# Altium project homecomputer-6502.PrjPcb
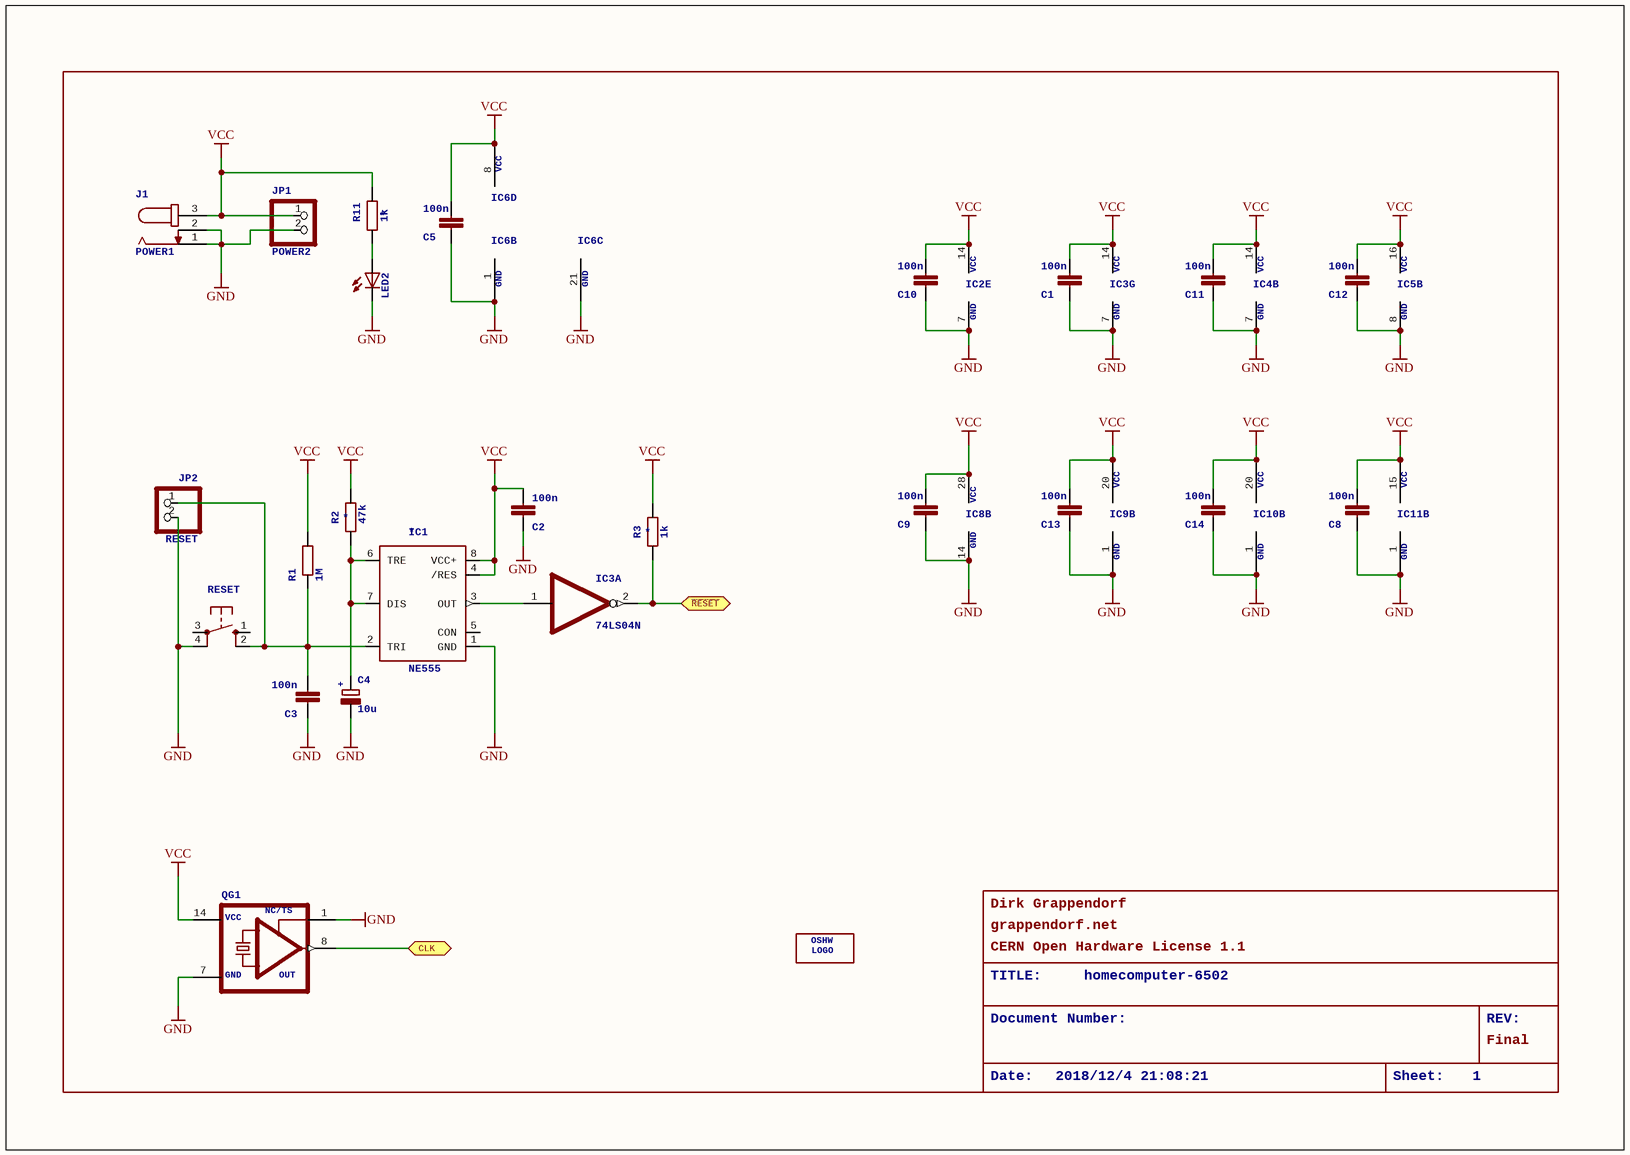
[diagram p0: homecomputer-6502_0.SchDoc]
6 sheets, 66 parts. Net scope: flat (ports and power ports of the same name join across sheets).
Board file: homecomputer-6502.PcbDoc
Sheets:
  homecomputer-6502_0.SchDoc
  homecomputer-6502_1.SchDoc
  homecomputer-6502_2.SchDoc
  homecomputer-6502_3.SchDoc
  homecomputer-6502_4.SchDoc
  homecomputer-6502_5.SchDoc

## Sheet homecomputer-6502_0.SchDoc: homecomputer-6502
size 286 x 202 mm; Date: 2018/12/4 21:08:21; SheetNumber: 1

### Parts
(Parts that share a designator on the sheet are numbered #1, #2 ... from top to bottom, then left to right.)
C1  100n  [C025-024X044]
C2  100n  [C025-024X044]
C3  100n  [C025-024X044]
C4  10u  [E2,5-6E]
C5  100n  [C025-024X044]
C8  100n  [C025-024X044]
C9  100n  [C025-024X044]
C10  100n  [C025-024X044]
C11  100n  [C025-024X044]
C12  100n  [C025-024X044]
C13  100n  [C025-024X044]
C14  100n  [C025-024X044]
IC1  NE555  [DIL-08]
IC2  74LS00N  [DIL14]  (value not drawn)  (part E of 5)
IC3  74LS04N  [DIL14]  (parts A,G of 7)
IC4  74*30N  [DIL14]  (value not drawn)  (part B of 2)
IC5  74*137N  [DIL16]  (value not drawn)  (part B of 2)
IC6  6502  [DIP40]  (value not drawn)  (parts B,C,D of 4)
IC8  61256  [DIL28-3]  (value not drawn)  (part B of 2)
IC9  6522  [DIP40]  (value not drawn)  (part B of 2)
IC10  6522  [DIP40]  (value not drawn)  (part B of 2)
IC11  6551  [DIP28]  (value not drawn)  (part B of 2)
J1  POWER1  [SPC4078]
JP1  POWER2  [1X02]
JP2  RESET  [1X02]
LED2  LED3MM  [LED3MM]  (value not drawn)
LOGO1  OSHW_LOGO_8MILX0350-NT  [OSHW_8X350_NOTEXT]  (value not drawn)
QG1  XO-14  [DIL14S]  (value not drawn)
R1  1M  [0204/7]
R2  47k  [0204/7]
R3  1k  [0204/7]
R11#1  1k  [0204/7]
RESET  10-XX  [B3F-10XX]  (value not drawn)

### Ports
CLK, ~{RESET}

### Nets
GND: C1.1 C2.1 C3.1 C4.- C5.1 C8.1 C9.1 C10.1 C11.1 C12.1 C13.1 C14.1 IC1.1(GND) IC2.7(GND) IC3.7(GND) IC4.7(GND) IC5.8(GND) IC6.1(GND) IC6.21(GND) IC8.14(GND) IC9.1(GND) IC10.1(GND) IC11.1(GND) J1.1 J1.2 JP1.2 JP2.2 LED2.K(C) QG1.1(TS) QG1.7(GND) RESET.4(P1)
VCC: C1.2 C2.2 C5.2 C8.2 C9.2 C10.2 C11.2 C12.2 C13.2 C14.2 IC1.4(/RES) IC1.8(VCC+) IC2.14(VCC) IC3.14(VCC) IC4.14(VCC) IC5.16(VCC) IC6.8(VCC) IC8.28(VCC) IC9.20(VCC) IC10.20(VCC) IC11.15(VCC) J1.3 JP1.1 QG1.14(VCC) R1.2 R2.2 R3.2 R11#1.2
NetC3_2: C3.2 IC1.2(TRI) JP2.1 R1.1 RESET.2(S1)
NetC4_+: C4.+ IC1.6(TRE) IC1.7(DIS) R2.1
NetIC1_3: IC1.3(OUT) IC3.1(I)
NetIC3_2: IC3.2(O) R3.1 ; port ~{RESET}
NetIC6_37: QG1.8(OUT) ; port CLK
NetLED2_A: LED2.A R11#1.1

Not connected (* = marked no-connect by the designer): IC1 5(CON); RESET 1(S) 3(P)

### Notes on the sheet
- Dirk Grappendorf
- grappendorf.net
- CERN Open Hardware License 1.1
- TITLE:
- Document Number:
- homecomputer-6502
- REV:
- Date:
- 2018/12/4 21:08:21
- Sheet:
- 1
- Final

### Library data of the parts
C1-C3 C5 C8-C14 = C-EU025-024X044: CAPACITOR, European symbol
C4 = CPOL-EUE2,5-6E: POLARIZED CAPACITOR, European symbol; +: +
IC1 = NE555: General purpose bipolar Timer; MPN: NE555N; MF: Arrow Electronics; NAME: *; OC_FARNELL: 1467742; OC_NEWARK: 89K1486
IC2 = 74*00N: Quad 2-input NAND gate; GND: GND; VCC: VCC
IC3 = 74*04N: Hex INVERTER
IC4 = 74*30N: 8-input NAND gate; GND: GND; VCC: VCC
IC5 = 74*137N: 3-line to 8-line DECODER/DEMULTIPLEXER, address LATCH; GND: GND; VCC: VCC
IC6 = 6502: 6502 processor; GND: GND
IC8 = 61256: MEMORY; GND: GND; VCC: VCC
IC9 IC10 = 6522: I/O device: two 8-bits ports, handshake lines, timers.; GND: GND; VCC: VCC
IC11 = 6551: ACIA. Capable of RS-232; GND: GND; VCC: VCC
J1 = JACK-PLUG1: DC POWER JACK Power Jack, DC, Right Angle, Through Hole, Rated 5A at 16VDC, PC Terminals   Distributor: Farnell (www.Farnell.de) Drawing: 84N1161.pdf / 84N1162.pdf Manufacturer: SPC Technology (www.spctechnology.com) Type: SPC4077 / SPC 4078; MF: *; MPN: *; OC_FARNELL: unknown; OC_NEWARK: unknown
JP1 JP2 = PINHD-1X2_2.54: PIN HEADER
LED2 = LED3MM: LED   OSRAM: - CHIPLED LG R971, LG N971, LY N971, LG Q971, LY Q971, LO R971, LY R971 LH N974, LH R974 LS Q976, LO Q976, LY Q976 LO Q996 - Hyper CHIPLED LW Q18S LB Q993, LB Q99A, LB R99A - SideLED LS A670, LO A670, LY A670, LG A670, LP A670 LB A673, LV A673, LT A673, LW A673 LH A674 LY A675 LS A676, LA A676, LO A676, LY A676, LW A676 LS A679, LY A679, LG A679 -  Hyper Micro SIDELED庐 LS Y876, LA Y876, LO Y876, LY Y876 LT Y87S - SmartLED LW L88C, LW L88S LB L89C, LB L89S, LG L890 LS L89K, LO L89K, LY L89K LS L896, LA L896, LO L896, LY L896 - TOPLED LS T670, LO T670, LY T670, LG T670, LP T670 LSG T670, LSP T670, LSY T670, LOP T670, LYG T670 LG T671, LOG T671, LSG T671 LB T673, LV T673, LT T673, LW T673 LH T674 LS T676, LA T676, LO T676, LY T676, LB T676, LH T676, LSB T676, LW T676 LB T67C, LV T67C, LT T67C, LS T67K, LO T67K, LY T67K, LW E67C LS E67B, LA E67B, LO E67B, LY E67B, LB E67C, LV E67C, LT E67C LW T67C LS T679, LY T679, LG T679 LS T770, LO T770, LY T770, LG T770, LP T770 LB T773, LV T773, LT T773, LW T773 LH T774 LS E675, LA E675, LY E675, LS T675 LS T776, LA T776, LO T776, LY T776, LB T776 LHGB T686 LT T68C, LB T68C - Hyper Mini TOPLED庐 LB M676 - Mini TOPLED Santana庐 LG M470 LS M47K, LO M47K, LY M47K    Source: http://www.osram.convergy.de   LUXEON: - LUMILED庐 LXK2-PW12-R00, LXK2-PW12-S00, LXK2-PW14-U00, LXK2-PW14-V00 LXK2-PM12-R00, LXK2-PM12-S00, LXK2-PM14-U00 LXK2-PE12-Q00, LXK2-PE12-R00, LXK2-PE12-S00, LXK2-PE14-T00, LXK2-PE14-U00 LXK2-PB12-K00, LXK2-PB12-L00, LXK2-PB12-M00, LXK2-PB14-N00, LXK2-PB14-P00, LXK2-PB14-Q00 LXK2-PR12-L00, LXK2-PR12-M00, LXK2-PR14-Q00, LXK2-PR14-R00 LXK2-PD12-Q00, LXK2-PD12-R00, LXK2-PD12-S00 LXK2-PH12-R00, LXK2-PH12-S00 LXK2-PL12-P00, LXK2-PL12-Q00, LXK2-PL12-R00    Source: www.luxeon.com   KINGBRIGHT:   KA-3528ASYC Source: www.kingbright.com
QG1 = XO-14: CRYSTAL; OUT: OUT; GND: GND; VCC: VCC; NC/TS: NC/TS
R1-R3 R11#1 = R-EU_0204/7: RESISTOR, European symbol
  R2 R3 R11#1: NAME: *
RESET = 10-XX: OMRON SWITCH; MPN: B3F-1000; MF: *; OC_FARNELL: 176432; OC_NEWARK: 36M3542
LOGO1 = OSHW_LOGO_8MILX0350-NT: OSHW: OSHW; LOGO: LOGO

## Sheet homecomputer-6502_1.SchDoc: homecomputer-6502
size 286 x 202 mm; Date: 2018/12/4 21:08:23; SheetNumber: 2
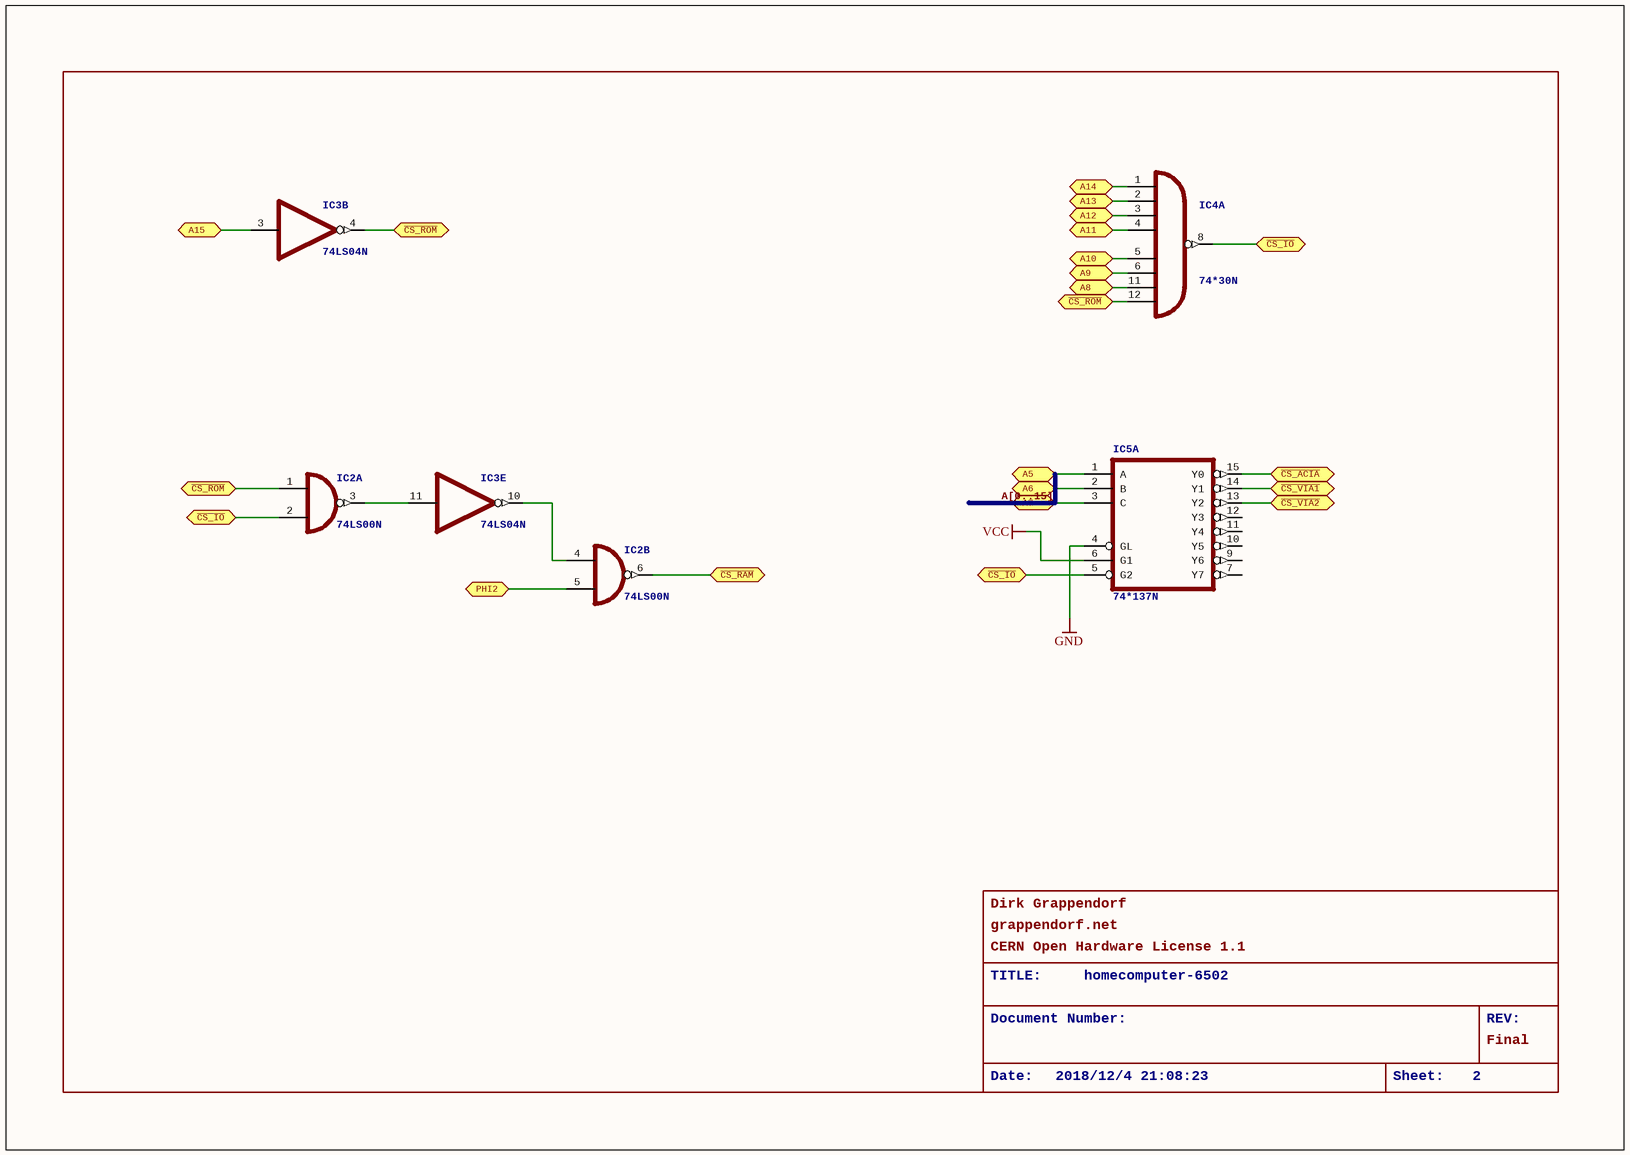
[diagram p1: homecomputer-6502_1.SchDoc]

### Parts
IC2  74LS00N  [DIL14]  (parts A,B of 5)
IC3  74LS04N  [DIL14]  (parts B,E of 7)
IC4  74*30N  [DIL14]  (part A of 2)
IC5  74*137N  [DIL16]  (part A of 2)

### Ports
A5, A6, A7, A8, A9, A10, A11, A12, A13, A14, A15, PHI2, ~{CS_ACIA}, ~{CS_IO}, ~{CS_RAM}, ~{CS_ROM}, ~{CS_VIA1}, ~{CS_VIA2}

### Nets
GND: IC5.4(GL)
VCC: IC5.6(G1)
A[0..15]: IC4.2(I1) ; port A13
A[0..15]: IC5.2(B) ; port A6  [a separate net that carries the same name]
NetIC2_1: IC2.1(I0) IC3.4(O) IC4.12(I7) ; port ~{CS_ROM}
NetIC2_2: IC2.2(I1) IC4.8(O) IC5.5(G2) ; port ~{CS_IO}
NetIC2_3: IC2.3(O) IC3.11(I)
NetIC2_4: IC2.4(I0) IC3.10(O)
NetIC2_5: IC2.5(I1) ; port PHI2
NetIC2_6: IC2.6(O) ; port ~{CS_RAM}
NetIC3_3: IC3.3(I) ; port A15
NetIC4_1: IC4.1(I0) ; port A14
NetIC4_3: IC4.3(I2) ; port A12
NetIC4_4: IC4.4(I3) ; port A11
NetIC4_5: IC4.5(I4) ; port A10
NetIC4_6: IC4.6(I5) ; port A9
NetIC4_11: IC4.11(I6) ; port A8
NetIC5_1: IC5.1(A) ; port A5
NetIC5_3: IC5.3(C) ; port A7
NetIC5_13: IC5.13(Y2) ; port ~{CS_VIA2}
NetIC5_14: IC5.14(Y1) ; port ~{CS_VIA1}
NetIC5_15: IC5.15(Y0) ; port ~{CS_ACIA}

Not connected (* = marked no-connect by the designer): IC5 7(Y7) 9(Y6) 10(Y5) 11(Y4) 12(Y3)

### Notes on the sheet
- Dirk Grappendorf
- grappendorf.net
- CERN Open Hardware License 1.1
- TITLE:
- Document Number:
- homecomputer-6502
- REV:
- Date:
- 2018/12/4 21:08:23
- Sheet:
- 2
- Final

### Library data of the parts
IC2 = 74*00N: Quad 2-input NAND gate
IC3 = 74*04N: Hex INVERTER
IC4 = 74*30N: 8-input NAND gate
IC5 = 74*137N: as IC5 on sheet homecomputer-6502_0

## Sheet homecomputer-6502_2.SchDoc: homecomputer-6502
size 286 x 202 mm; Date: 2018/12/4 21:08:25; SheetNumber: 3
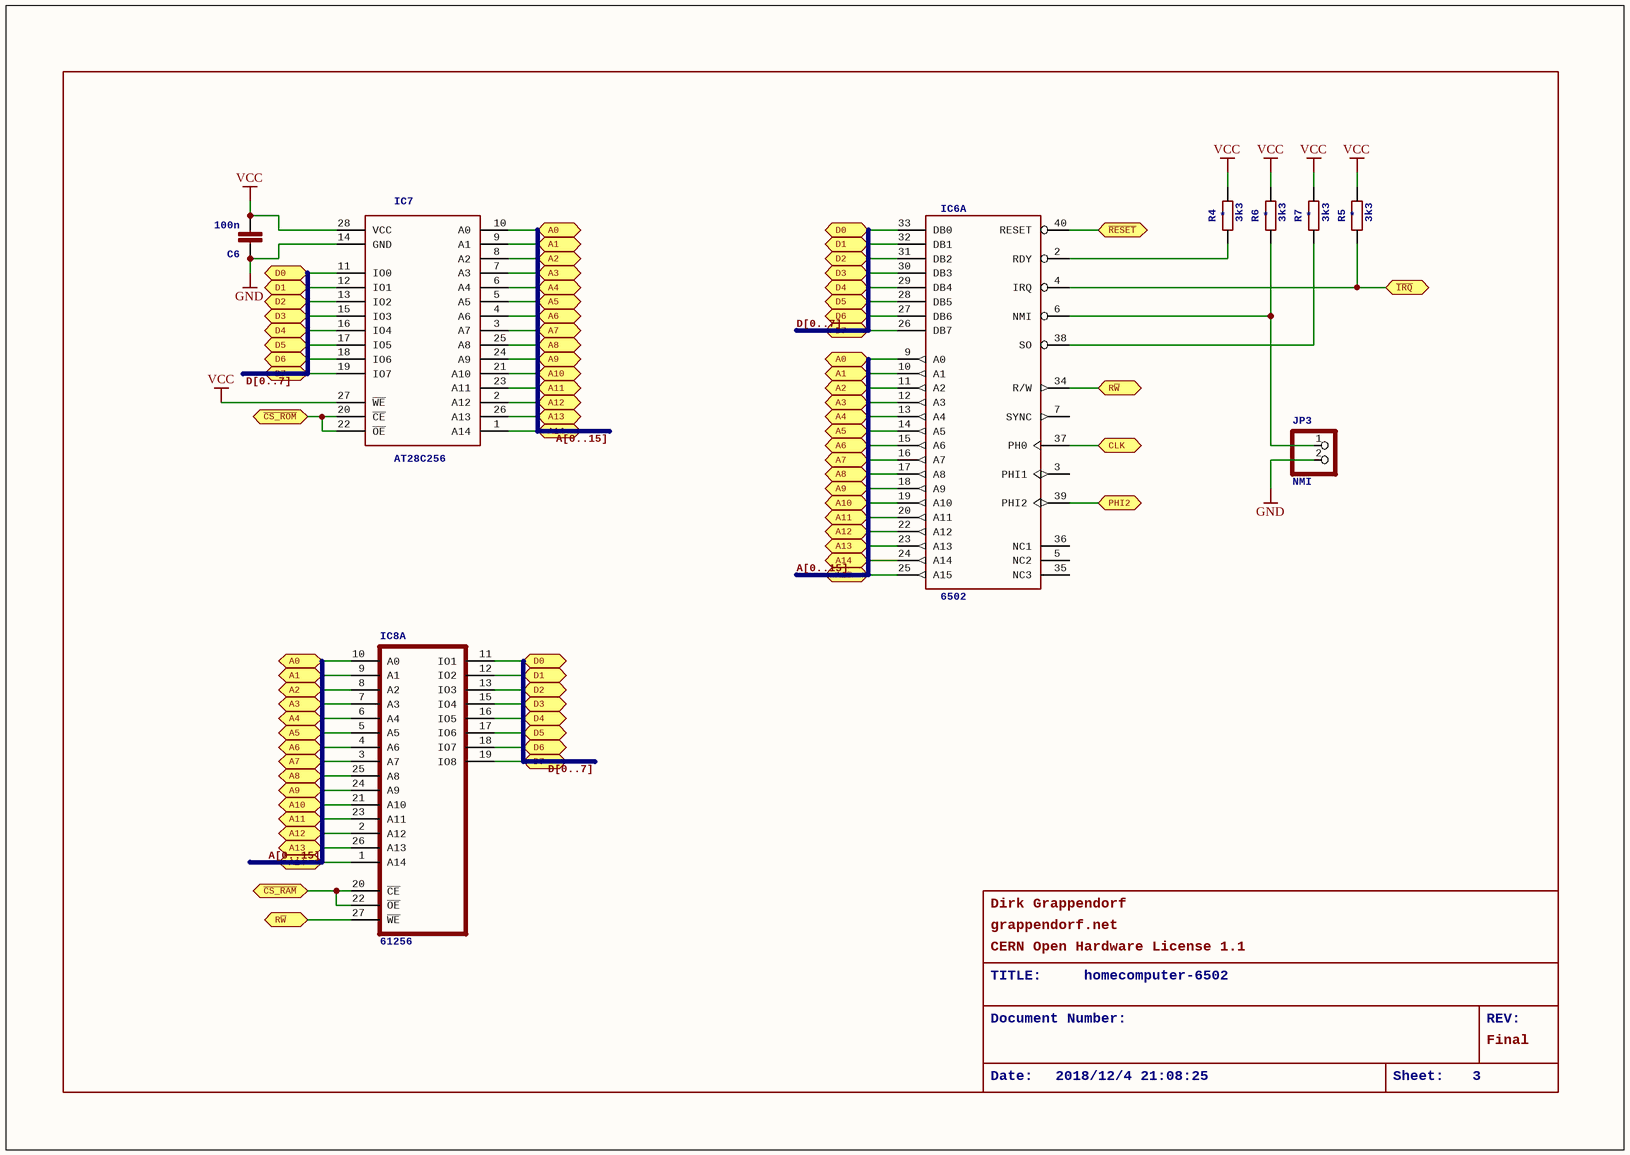
[diagram p2: homecomputer-6502_2.SchDoc]

### Parts
C6  100n  [C025-024X044]
IC6  6502  [DIP40]  (part A of 4)
IC7  AT28C256  [DIL28-6]
IC8  61256  [DIL28-3]  (part A of 2)
JP3  NMI  [1X02]
R4  3k3  [0204/7]
R5  3k3  [0204/7]
R6  3k3  [0204/7]
R7  3k3  [0204/7]

### Ports
A0, A1, A2, A3, A4, A5, A6, A7, A8, A9, A10, A11, A12, A13, A14, A15, CLK, D0, D1, D2, D3, D4, D5, D6, D7, PHI2, R~{W}, ~{CS_RAM}, ~{CS_ROM}, ~{IRQ}, ~{RESET}

### Nets
GND: C6.1 IC7.14(GND) JP3.2
VCC: C6.2 IC7.27(~{WE}) IC7.28(VCC) R4.2 R5.2 R6.2 R7.2
A[0..15]: IC6.23(A13) IC7.26(A13) IC8.26(A13) ; port A13
A[0..15]: IC6.15(A6) IC7.4(A6) IC8.4(A6) ; port A6  [a separate net that carries the same name]
A[0..15]: IC6.11(A2) IC7.8(A2) IC8.8(A2) ; port A2  [a separate net that carries the same name]
NetIC2_1: IC7.20(~{CE}) IC7.22(~{OE}) ; port ~{CS_ROM}
NetIC2_5: IC6.39(PHI2) ; port PHI2
NetIC2_6: IC8.20(~{CE}) IC8.22(~{OE}) ; port ~{CS_RAM}
NetIC3_2: IC6.40(RESET) ; port ~{RESET}
NetIC3_3: IC6.25(A15) ; port A15
NetIC4_1: IC6.24(A14) IC7.1(A14) IC8.1(A14) ; port A14
NetIC4_3: IC6.22(A12) IC7.2(A12) IC8.2(A12) ; port A12
NetIC4_4: IC6.20(A11) IC7.23(A11) IC8.23(A11) ; port A11
NetIC4_5: IC6.19(A10) IC7.21(A10) IC8.21(A10) ; port A10
NetIC4_6: IC6.18(A9) IC7.24(A9) IC8.24(A9) ; port A9
NetIC4_11: IC6.17(A8) IC7.25(A8) IC8.25(A8) ; port A8
NetIC5_1: IC6.14(A5) IC7.5(A5) IC8.5(A5) ; port A5
NetIC5_3: IC6.16(A7) IC7.3(A7) IC8.3(A7) ; port A7
NetIC6_2: IC6.2(RDY) R4.1
NetIC6_4: IC6.4(IRQ) R5.1 ; port ~{IRQ}
NetIC6_6: IC6.6(NMI) JP3.1 R6.1
NetIC6_9: IC6.9(A0) IC7.10(A0) IC8.10(A0) ; port A0
NetIC6_10: IC6.10(A1) IC7.9(A1) IC8.9(A1) ; port A1
NetIC6_12: IC6.12(A3) IC7.7(A3) IC8.7(A3) ; port A3
NetIC6_13: IC6.13(A4) IC7.6(A4) IC8.6(A4) ; port A4
NetIC6_26: IC6.26(DB7) IC7.19(IO7) IC8.19(IO8) ; port D7
NetIC6_27: IC6.27(DB6) IC7.18(IO6) IC8.18(IO7) ; port D6
NetIC6_28: IC6.28(DB5) IC7.17(IO5) IC8.17(IO6) ; port D5
NetIC6_29: IC6.29(DB4) IC7.16(IO4) IC8.16(IO5) ; port D4
NetIC6_30: IC6.30(DB3) IC7.15(IO3) IC8.15(IO4) ; port D3
NetIC6_31: IC6.31(DB2) IC7.13(IO2) IC8.13(IO3) ; port D2
NetIC6_32: IC6.32(DB1) IC7.12(IO1) IC8.12(IO2) ; port D1
NetIC6_33: IC6.33(DB0) IC7.11(IO0) IC8.11(IO1) ; port D0
NetIC6_34: IC6.34(R/W) IC8.27(~{WE}) ; port R~{W}
NetIC6_37: IC6.37(PH0) ; port CLK
NetIC6_38: IC6.38(SO) R7.1

Not connected (* = marked no-connect by the designer): IC6 3(PHI1) 5(NC2) 7(SYNC) 35(NC3) 36(NC1)

### Buses and harness runs
bus A[0..15]
bus D[0..7]

### Notes on the sheet
- Dirk Grappendorf
- grappendorf.net
- CERN Open Hardware License 1.1
- TITLE:
- Document Number:
- homecomputer-6502
- REV:
- Date:
- 2018/12/4 21:08:25
- Sheet:
- 3
- Final

### Library data of the parts
C6 = C-EU025-024X044: CAPACITOR, European symbol
IC6 = 6502: 6502 processor
IC7 = AT28C256: EEPROM 32Kx8 256k bit   The AT28C256 is a high-performance Electrically Erasable and Programmable Read Only Memory. Its 256K of memory is organized as 32,768 words by 8 bits.
IC8 = 61256: MEMORY
JP3 = PINHD-1X2_2.54: PIN HEADER
R4-R7 = R-EU_0204/7: RESISTOR, European symbol; NAME: *

## Sheet homecomputer-6502_3.SchDoc: homecomputer-6502
size 286 x 202 mm; Date: 2018/12/4 21:08:27; SheetNumber: 4
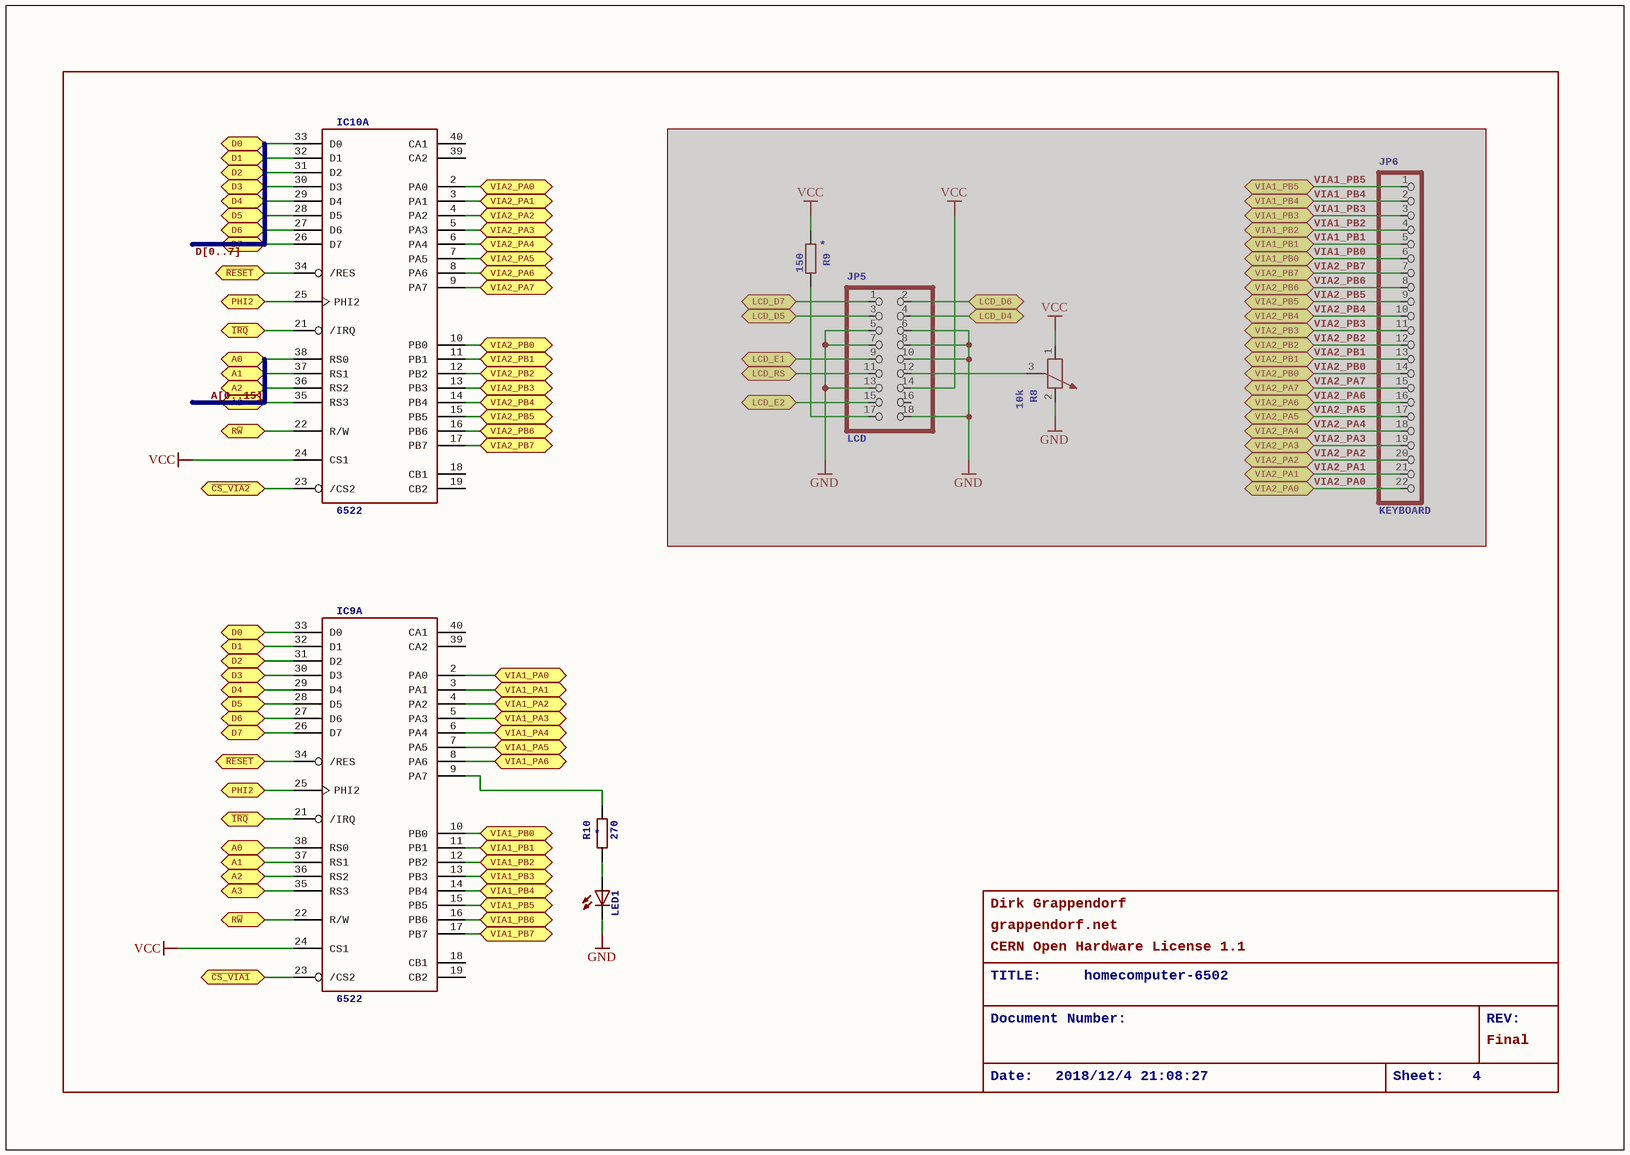
[diagram p3: homecomputer-6502_3.SchDoc]

### Parts
IC9  6522  [DIP40]  (part A of 2)
IC10  6522  [DIP40]  (part A of 2)
JP5  LCD  [2X09]  (masked out: inside a compile mask, not in the netlist)
JP6  KEYBOARD  [1X22]  (masked out: inside a compile mask, not in the netlist)
LED1  LED3MM  [LED3MM]  (value not drawn)
R8  10k  [PT-10]  (masked out: inside a compile mask, not in the netlist)
R9  150  [0204/7]  (masked out: inside a compile mask, not in the netlist)
R10  270  [0204/7]

### Ports
A0, A1, A2, A3, D0, D1, D2, D3, D4, D5, D6, D7, LCD_D4, LCD_D5, LCD_D6, LCD_D7, LCD_E1, LCD_E2, LCD_RS, PHI2, R~{W}, VIA1_PA0, VIA1_PA1, VIA1_PA2, VIA1_PA3, VIA1_PA4, VIA1_PA5, VIA1_PA6, VIA1_PB0, VIA1_PB1, VIA1_PB2, VIA1_PB3, VIA1_PB4, VIA1_PB5, VIA1_PB6, VIA1_PB7, VIA2_PA0, VIA2_PA1, VIA2_PA2, VIA2_PA3, VIA2_PA4, VIA2_PA5, VIA2_PA6, VIA2_PA7, VIA2_PB0, VIA2_PB1, VIA2_PB2, VIA2_PB3, VIA2_PB4, VIA2_PB5, VIA2_PB6, VIA2_PB7, ~{CS_VIA1}, ~{CS_VIA2}, ~{IRQ}, ~{RESET}

### Nets
GND: LED1.K(C)
VCC: IC9.24(CS1) IC10.24(CS1)
A[0..15]: IC9.36(RS2) IC10.36(RS2) ; port A2
VIA1_PB0: IC9.10(PB0) ; port VIA1_PB0
VIA1_PB1: IC9.11(PB1) ; port VIA1_PB1
VIA1_PB2: IC9.12(PB2) ; port VIA1_PB2
VIA1_PB3: IC9.13(PB3) ; port VIA1_PB3
VIA2_PA0: IC10.2(PA0) ; port VIA2_PA0
VIA2_PA1: IC10.3(PA1) ; port VIA2_PA1
VIA2_PA2: IC10.4(PA2) ; port VIA2_PA2
VIA2_PA3: IC10.5(PA3) ; port VIA2_PA3
VIA2_PA4: IC10.6(PA4) ; port VIA2_PA4
VIA2_PA5: IC10.7(PA5) ; port VIA2_PA5
VIA2_PA6: IC10.8(PA6) ; port VIA2_PA6
VIA2_PA7: IC10.9(PA7) ; port VIA2_PA7
VIA2_PB0: IC10.10(PB0) ; port VIA2_PB0
VIA2_PB1: IC10.11(PB1) ; port VIA2_PB1
VIA2_PB2: IC10.12(PB2) ; port VIA2_PB2
VIA2_PB3: IC10.13(PB3) ; port VIA2_PB3
VIA2_PB4: IC10.14(PB4) ; port VIA2_PB4
VIA2_PB5: IC10.15(PB5) ; port VIA2_PB5
VIA2_PB6: IC10.16(PB6) ; port VIA2_PB6
VIA2_PB7: IC10.17(PB7) ; port VIA2_PB7
NetIC2_5: IC9.25(PHI2) IC10.25(PHI2) ; port PHI2
NetIC3_2: IC9.34(/RES) IC10.34(/RES) ; port ~{RESET}
NetIC5_13: IC10.23(/CS2) ; port ~{CS_VIA2}
NetIC5_14: IC9.23(/CS2) ; port ~{CS_VIA1}
NetIC6_4: IC9.21(/IRQ) IC10.21(/IRQ) ; port ~{IRQ}
NetIC6_9: IC9.38(RS0) IC10.38(RS0) ; port A0
NetIC6_10: IC9.37(RS1) IC10.37(RS1) ; port A1
NetIC6_12: IC9.35(RS3) IC10.35(RS3) ; port A3
NetIC6_26: IC9.26(D7) IC10.26(D7) ; port D7
NetIC6_27: IC9.27(D6) IC10.27(D6) ; port D6
NetIC6_28: IC9.28(D5) IC10.28(D5) ; port D5
NetIC6_29: IC9.29(D4) IC10.29(D4) ; port D4
NetIC6_30: IC9.30(D3) IC10.30(D3) ; port D3
NetIC6_31: IC9.31(D2) IC10.31(D2) ; port D2
NetIC6_32: IC9.32(D1) IC10.32(D1) ; port D1
NetIC6_33: IC9.33(D0) IC10.33(D0) ; port D0
NetIC6_34: IC9.22(R/W) IC10.22(R/W) ; port R~{W}
NetIC9_2: IC9.2(PA0) ; port VIA1_PA0
NetIC9_3: IC9.3(PA1) ; port VIA1_PA1
NetIC9_4: IC9.4(PA2) ; port VIA1_PA2
NetIC9_5: IC9.5(PA3) ; port VIA1_PA3
NetIC9_6: IC9.6(PA4) ; port VIA1_PA4
NetIC9_7: IC9.7(PA5) ; port VIA1_PA5
NetIC9_8: IC9.8(PA6) ; port VIA1_PA6
NetIC9_9: IC9.9(PA7) R10.2
NetIC9_14: IC9.14(PB4) ; port VIA1_PB4
NetIC9_15: IC9.15(PB5) ; port VIA1_PB5
NetIC9_16: IC9.16(PB6) ; port VIA1_PB6
NetIC9_17: IC9.17(PB7) ; port VIA1_PB7
NetLED1_A: LED1.A R10.1

Not connected (* = marked no-connect by the designer): IC9 18(CB1) 19(CB2) 39(CA2) 40(CA1); IC10 18(CB1) 19(CB2) 39(CA2) 40(CA1)

### Buses and harness runs
bus D[0..7]

### Notes on the sheet
- Dirk Grappendorf
- grappendorf.net
- CERN Open Hardware License 1.1
- TITLE:
- Document Number:
- homecomputer-6502
- REV:
- Date:
- 2018/12/4 21:08:27
- Sheet:
- 4
- Final

### Library data of the parts
IC9 IC10 = 6522: as IC9 on sheet homecomputer-6502_0
JP5 = PINHD-2X9_2.54: PIN HEADER
JP6 = PINHD-1X22_2.54: PIN HEADER
LED1 = LED3MM: as LED2 on sheet homecomputer-6502_0
R8 = POTENTIOMETER_PT-10: Potentiometer
R9 R10 = R-EU_0204/7: RESISTOR, European symbol; NAME: *

## Sheet homecomputer-6502_4.SchDoc: homecomputer-6502
size 286 x 202 mm; Date: 2018/12/4 21:08:29; SheetNumber: 5
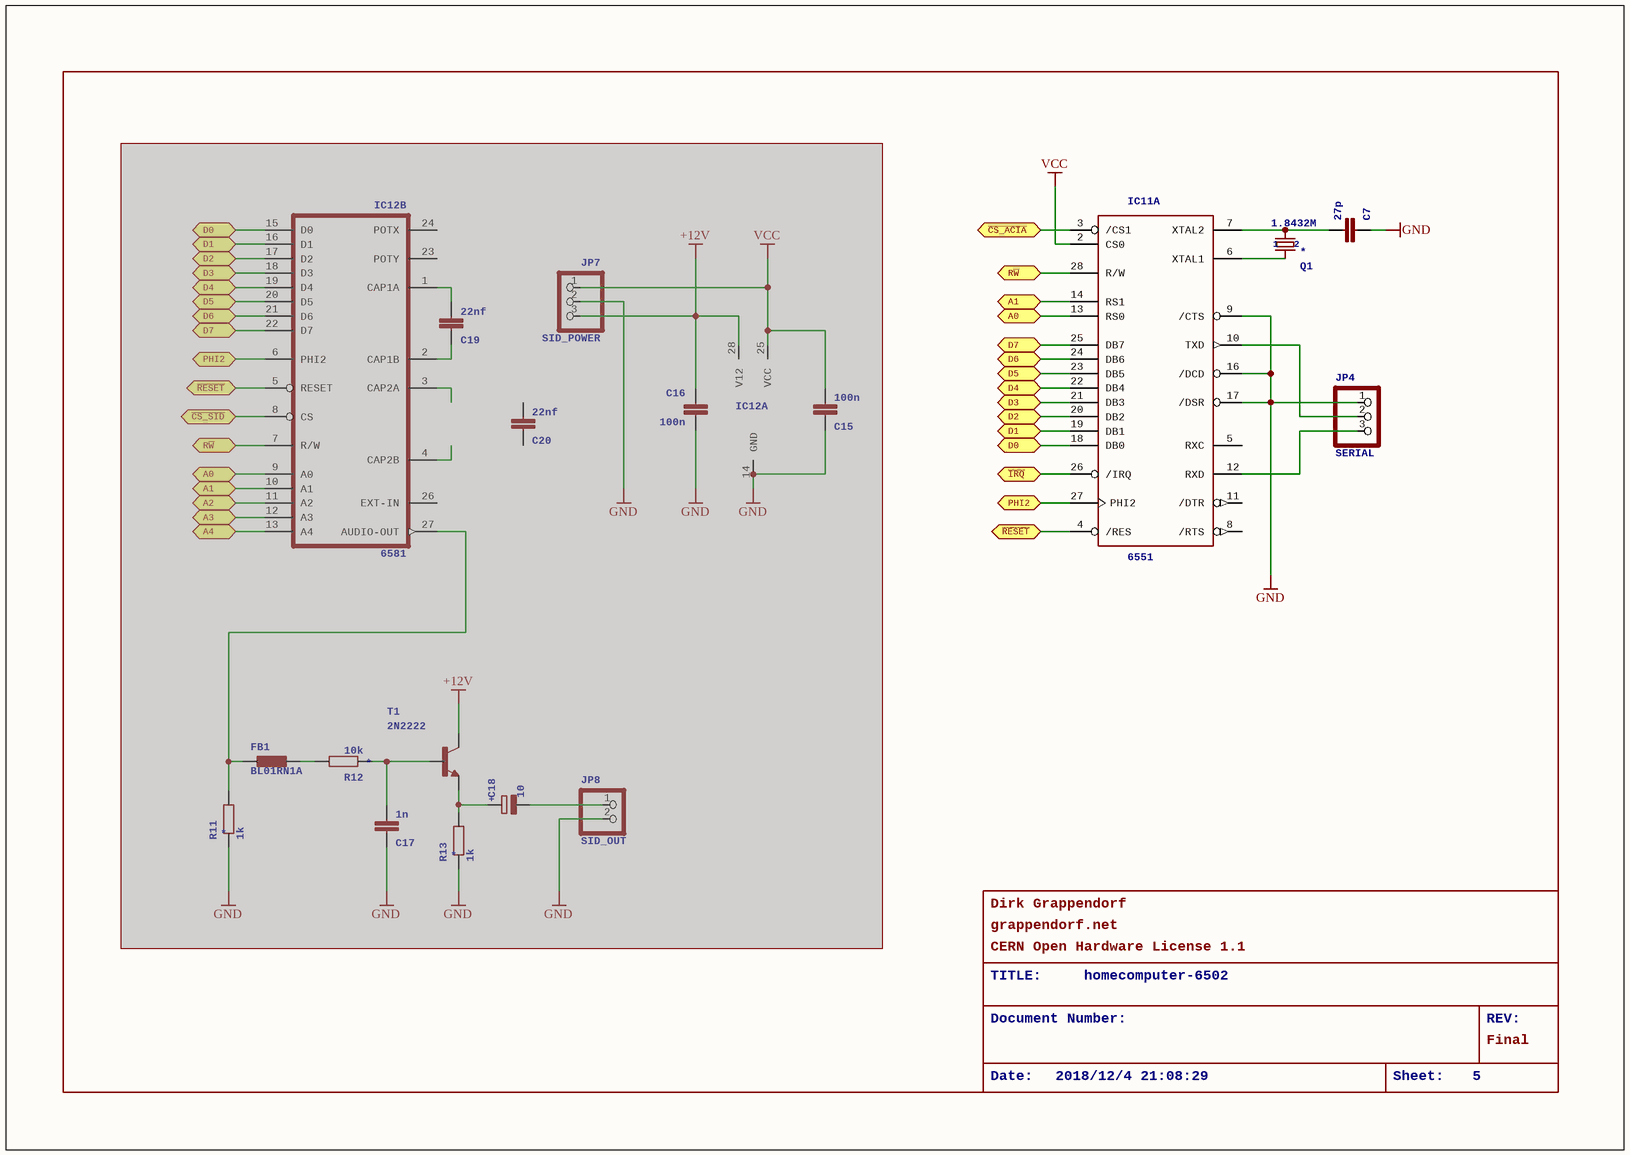
[diagram p4: homecomputer-6502_4.SchDoc]

### Parts
(Parts that share a designator on the sheet are numbered #1, #2 ... from top to bottom, then left to right.)
C7  27p  [C025-024X044]
C15  100n  [C025-024X044]  (masked out: inside a compile mask, not in the netlist)
C16  100n  [C025-024X044]  (masked out: inside a compile mask, not in the netlist)
C17  1n  [C025-024X044]  (masked out: inside a compile mask, not in the netlist)
C18  10  [E2,5-5]  (masked out: inside a compile mask, not in the netlist)
C19  22nf  [C025-024X044]  (masked out: inside a compile mask, not in the netlist)
C20  22nf  [C025-024X044]  (masked out: inside a compile mask, not in the netlist)
FB1  BL01RN1A  [BL01RN1A]  (masked out: inside a compile mask, not in the netlist)
IC11  6551  [DIP28]  (part A of 2)
IC12  6581  [DIL28]  (value not drawn)  (parts A,B of 2)  (masked out: inside a compile mask, not in the netlist)
JP4  SERIAL  [1X03]
JP7  SID_POWER  [1X03]  (masked out: inside a compile mask, not in the netlist)
JP8  SID_OUT  [1X02]  (masked out: inside a compile mask, not in the netlist)
Q1  1.8432M  [HC49U-V]
R11#2  1k  [0204/7]  (masked out: inside a compile mask, not in the netlist)
R12  10k  [0204/7]  (masked out: inside a compile mask, not in the netlist)
R13  1k  [0204/5]  (masked out: inside a compile mask, not in the netlist)
T1  2N2222  [TO18]  (masked out: inside a compile mask, not in the netlist)

### Ports
A0, A1, A2, A3, A4, D0, D1, D2, D3, D4, D5, D6, D7, PHI2, R~{W}, ~{CS_ACIA}, ~{CS_SID}, ~{IRQ}, ~{RESET}

### Nets
GND: C7.1 IC11.9(/CTS) IC11.16(/DCD) IC11.17(/DSR) JP4.1
VCC: IC11.2(CS0)
NetC7_2: C7.2 IC11.7(XTAL2) Q1.2
NetIC2_5: IC11.27(PHI2) ; port PHI2
NetIC3_2: IC11.4(/RES) ; port ~{RESET}
NetIC5_15: IC11.3(/CS1) ; port ~{CS_ACIA}
NetIC6_4: IC11.26(/IRQ) ; port ~{IRQ}
NetIC6_9: IC11.13(RS0) ; port A0
NetIC6_10: IC11.14(RS1) ; port A1
NetIC6_26: IC11.25(DB7) ; port D7
NetIC6_27: IC11.24(DB6) ; port D6
NetIC6_28: IC11.23(DB5) ; port D5
NetIC6_29: IC11.22(DB4) ; port D4
NetIC6_30: IC11.21(DB3) ; port D3
NetIC6_31: IC11.20(DB2) ; port D2
NetIC6_32: IC11.19(DB1) ; port D1
NetIC6_33: IC11.18(DB0) ; port D0
NetIC6_34: IC11.28(R/W) ; port R~{W}
NetIC11_6: IC11.6(XTAL1) Q1.1
NetIC11_10: IC11.10(TXD) JP4.2
NetIC11_12: IC11.12(RXD) JP4.3

Not connected (* = marked no-connect by the designer): IC11 5(RXC) 8(/RTS) 11(/DTR)

### Notes on the sheet
- Dirk Grappendorf
- grappendorf.net
- CERN Open Hardware License 1.1
- TITLE:
- Document Number:
- homecomputer-6502
- REV:
- Date:
- 2018/12/4 21:08:29
- Sheet:
- 5
- Final

### Library data of the parts
C7 C15-C17 C19 C20 = C-EU025-024X044: CAPACITOR, European symbol
C18 = CPOL-EUE2.5-5: POLARIZED CAPACITOR, European symbol; +: +
FB1 = BL01RN1A: Noise Suppression Products/EMI Suppression Filters, Lead EMIFIL(R) Inductor Type   Source: http://www.murata.com .. BL01RN1_DS.pdf
IC11 = 6551: ACIA. Capable of RS-232
IC12 = 6581: Sound IC, used in Comoodore 64 and Comoodore 128. 12 Volt Version. 8580 is the 9 Volt pin compatible version used in the C64C.
JP4 JP7 = PINHD-1X3_2.54: PIN HEADER
JP8 = PINHD-1X2_2.54: PIN HEADER
Q1 = CRYSTALHC49U-V: CRYSTAL; MF: *; MPN: *; NAME: *; OC_FARNELL: 1666969; OC_NEWARK: unknown; 1: 1; 2: 2
R11#2 R12 = R-EU_0204/7: RESISTOR, European symbol; NAME: *
R13 = R-EU_0204/5: RESISTOR, European symbol; NAME: *
T1 = 2N2222: NPN TRANSISTOR

## Sheet homecomputer-6502_5.SchDoc
size A4
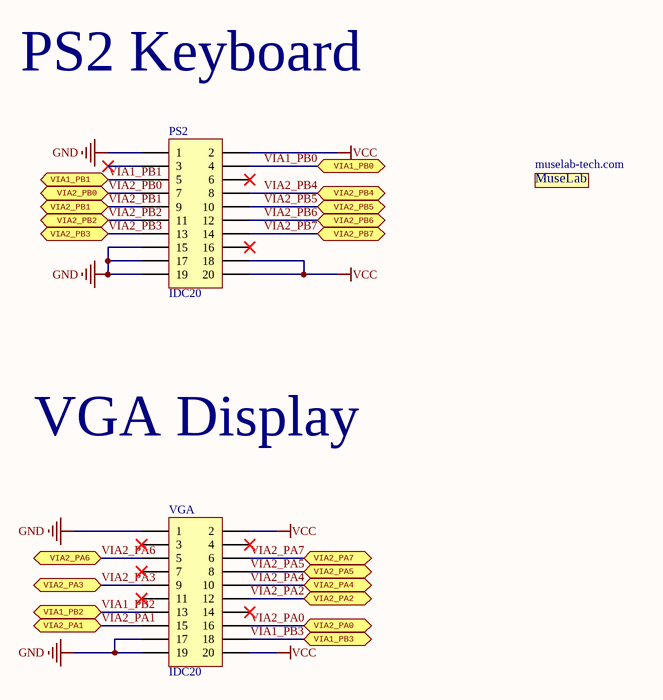
[diagram p5: homecomputer-6502_5.SchDoc]

### Parts
muselab-tech.com  LOGO_MuseLab  [LOGO_MUSELAB]  (value not drawn)
PS2  IDC20  [IDC20]
VGA  IDC20  [IDC20]

### Ports
VIA1_PB0, VIA1_PB1, VIA1_PB2, VIA1_PB3, VIA2_PA0, VIA2_PA1, VIA2_PA2, VIA2_PA3, VIA2_PA4, VIA2_PA5, VIA2_PA6, VIA2_PA7, VIA2_PB0, VIA2_PB1, VIA2_PB2, VIA2_PB3, VIA2_PB4, VIA2_PB5, VIA2_PB6, VIA2_PB7

### Nets
GND: PS2.1 PS2.15 PS2.17 PS2.19 VGA.1 VGA.17 VGA.19
VCC: PS2.2 PS2.18 PS2.20 VGA.2 VGA.20
VIA1_PB0: PS2.4 ; port VIA1_PB0
VIA1_PB1: PS2.5 ; port VIA1_PB1
VIA1_PB2: VGA.13 ; port VIA1_PB2
VIA1_PB3: VGA.18 ; port VIA1_PB3
VIA2_PA0: VGA.16 ; port VIA2_PA0
VIA2_PA1: VGA.15 ; port VIA2_PA1
VIA2_PA2: VGA.12 ; port VIA2_PA2
VIA2_PA3: VGA.9 ; port VIA2_PA3
VIA2_PA4: VGA.10 ; port VIA2_PA4
VIA2_PA5: VGA.8 ; port VIA2_PA5
VIA2_PA6: VGA.5 ; port VIA2_PA6
VIA2_PA7: VGA.6 ; port VIA2_PA7
VIA2_PB0: PS2.7 ; port VIA2_PB0
VIA2_PB1: PS2.9 ; port VIA2_PB1
VIA2_PB2: PS2.11 ; port VIA2_PB2
VIA2_PB3: PS2.13 ; port VIA2_PB3
VIA2_PB4: PS2.8 ; port VIA2_PB4
VIA2_PB5: PS2.10 ; port VIA2_PB5
VIA2_PB6: PS2.12 ; port VIA2_PB6
VIA2_PB7: PS2.14 ; port VIA2_PB7

Not connected (* = marked no-connect by the designer): PS2 3* 6* 16*; VGA 3* 4* 7* 11* 14*

### Notes on the sheet
- PS2 Keyboard
- VGA Display
- (in symbol LOGO_MuseLab) MuseLab

## Nets that join several sheets
GND: homecomputer-6502_0 (31 pins), homecomputer-6502_1 (IC5.4), homecomputer-6502_2 (C6.1 IC7.14 JP3.2), homecomputer-6502_3 (LED1.K), homecomputer-6502_4 (5 pins), homecomputer-6502_5 (7 pins)
VCC: homecomputer-6502_0 (28 pins), homecomputer-6502_1 (IC5.6), homecomputer-6502_2 (7 pins), homecomputer-6502_3 (IC9.24 IC10.24), homecomputer-6502_4 (IC11.2), homecomputer-6502_5 (5 pins)
A[0..15]: homecomputer-6502_1 (IC4.2), homecomputer-6502_2 (IC6.23 IC7.26 IC8.26)
A[0..15]: homecomputer-6502_1 (IC5.2), homecomputer-6502_2 (IC6.15 IC7.4 IC8.4)
A[0..15]: homecomputer-6502_2 (IC6.11 IC7.8 IC8.8), homecomputer-6502_3 (IC9.36 IC10.36)
NetIC2_1: homecomputer-6502_1 (IC2.1 IC3.4 IC4.12), homecomputer-6502_2 (IC7.20 IC7.22)
NetIC2_5: homecomputer-6502_1 (IC2.5), homecomputer-6502_2 (IC6.39), homecomputer-6502_3 (IC9.25 IC10.25), homecomputer-6502_4 (IC11.27)
NetIC2_6: homecomputer-6502_1 (IC2.6), homecomputer-6502_2 (IC8.20 IC8.22)
NetIC3_2: homecomputer-6502_0 (IC3.2 R3.1), homecomputer-6502_2 (IC6.40), homecomputer-6502_3 (IC9.34 IC10.34), homecomputer-6502_4 (IC11.4)
NetIC3_3: homecomputer-6502_1 (IC3.3), homecomputer-6502_2 (IC6.25)
NetIC4_1: homecomputer-6502_1 (IC4.1), homecomputer-6502_2 (IC6.24 IC7.1 IC8.1)
NetIC4_3: homecomputer-6502_1 (IC4.3), homecomputer-6502_2 (IC6.22 IC7.2 IC8.2)
NetIC4_4: homecomputer-6502_1 (IC4.4), homecomputer-6502_2 (IC6.20 IC7.23 IC8.23)
NetIC4_5: homecomputer-6502_1 (IC4.5), homecomputer-6502_2 (IC6.19 IC7.21 IC8.21)
NetIC4_6: homecomputer-6502_1 (IC4.6), homecomputer-6502_2 (IC6.18 IC7.24 IC8.24)
NetIC4_11: homecomputer-6502_1 (IC4.11), homecomputer-6502_2 (IC6.17 IC7.25 IC8.25)
NetIC5_1: homecomputer-6502_1 (IC5.1), homecomputer-6502_2 (IC6.14 IC7.5 IC8.5)
NetIC5_3: homecomputer-6502_1 (IC5.3), homecomputer-6502_2 (IC6.16 IC7.3 IC8.3)
NetIC5_13: homecomputer-6502_1 (IC5.13), homecomputer-6502_3 (IC10.23)
NetIC5_14: homecomputer-6502_1 (IC5.14), homecomputer-6502_3 (IC9.23)
NetIC5_15: homecomputer-6502_1 (IC5.15), homecomputer-6502_4 (IC11.3)
NetIC6_4: homecomputer-6502_2 (IC6.4 R5.1), homecomputer-6502_3 (IC9.21 IC10.21), homecomputer-6502_4 (IC11.26)
NetIC6_9: homecomputer-6502_2 (IC6.9 IC7.10 IC8.10), homecomputer-6502_3 (IC9.38 IC10.38), homecomputer-6502_4 (IC11.13)
NetIC6_10: homecomputer-6502_2 (IC6.10 IC7.9 IC8.9), homecomputer-6502_3 (IC9.37 IC10.37), homecomputer-6502_4 (IC11.14)
NetIC6_12: homecomputer-6502_2 (IC6.12 IC7.7 IC8.7), homecomputer-6502_3 (IC9.35 IC10.35)
NetIC6_26: homecomputer-6502_2 (IC6.26 IC7.19 IC8.19), homecomputer-6502_3 (IC9.26 IC10.26), homecomputer-6502_4 (IC11.25)
NetIC6_27: homecomputer-6502_2 (IC6.27 IC7.18 IC8.18), homecomputer-6502_3 (IC9.27 IC10.27), homecomputer-6502_4 (IC11.24)
NetIC6_28: homecomputer-6502_2 (IC6.28 IC7.17 IC8.17), homecomputer-6502_3 (IC9.28 IC10.28), homecomputer-6502_4 (IC11.23)
NetIC6_29: homecomputer-6502_2 (IC6.29 IC7.16 IC8.16), homecomputer-6502_3 (IC9.29 IC10.29), homecomputer-6502_4 (IC11.22)
NetIC6_30: homecomputer-6502_2 (IC6.30 IC7.15 IC8.15), homecomputer-6502_3 (IC9.30 IC10.30), homecomputer-6502_4 (IC11.21)
NetIC6_31: homecomputer-6502_2 (IC6.31 IC7.13 IC8.13), homecomputer-6502_3 (IC9.31 IC10.31), homecomputer-6502_4 (IC11.20)
NetIC6_32: homecomputer-6502_2 (IC6.32 IC7.12 IC8.12), homecomputer-6502_3 (IC9.32 IC10.32), homecomputer-6502_4 (IC11.19)
NetIC6_33: homecomputer-6502_2 (IC6.33 IC7.11 IC8.11), homecomputer-6502_3 (IC9.33 IC10.33), homecomputer-6502_4 (IC11.18)
NetIC6_34: homecomputer-6502_2 (IC6.34 IC8.27), homecomputer-6502_3 (IC9.22 IC10.22), homecomputer-6502_4 (IC11.28)
NetIC6_37: homecomputer-6502_0 (QG1.8), homecomputer-6502_2 (IC6.37)
VIA1_PB0: homecomputer-6502_3 (IC9.10), homecomputer-6502_5 (PS2.4)
VIA1_PB1: homecomputer-6502_3 (IC9.11), homecomputer-6502_5 (PS2.5)
VIA1_PB2: homecomputer-6502_3 (IC9.12), homecomputer-6502_5 (VGA.13)
VIA1_PB3: homecomputer-6502_3 (IC9.13), homecomputer-6502_5 (VGA.18)
VIA2_PA0: homecomputer-6502_3 (IC10.2), homecomputer-6502_5 (VGA.16)
VIA2_PA1: homecomputer-6502_3 (IC10.3), homecomputer-6502_5 (VGA.15)
VIA2_PA2: homecomputer-6502_3 (IC10.4), homecomputer-6502_5 (VGA.12)
VIA2_PA3: homecomputer-6502_3 (IC10.5), homecomputer-6502_5 (VGA.9)
VIA2_PA4: homecomputer-6502_3 (IC10.6), homecomputer-6502_5 (VGA.10)
VIA2_PA5: homecomputer-6502_3 (IC10.7), homecomputer-6502_5 (VGA.8)
VIA2_PA6: homecomputer-6502_3 (IC10.8), homecomputer-6502_5 (VGA.5)
VIA2_PA7: homecomputer-6502_3 (IC10.9), homecomputer-6502_5 (VGA.6)
VIA2_PB0: homecomputer-6502_3 (IC10.10), homecomputer-6502_5 (PS2.7)
VIA2_PB1: homecomputer-6502_3 (IC10.11), homecomputer-6502_5 (PS2.9)
VIA2_PB2: homecomputer-6502_3 (IC10.12), homecomputer-6502_5 (PS2.11)
VIA2_PB3: homecomputer-6502_3 (IC10.13), homecomputer-6502_5 (PS2.13)
VIA2_PB4: homecomputer-6502_3 (IC10.14), homecomputer-6502_5 (PS2.8)
VIA2_PB5: homecomputer-6502_3 (IC10.15), homecomputer-6502_5 (PS2.10)
VIA2_PB6: homecomputer-6502_3 (IC10.16), homecomputer-6502_5 (PS2.12)
VIA2_PB7: homecomputer-6502_3 (IC10.17), homecomputer-6502_5 (PS2.14)